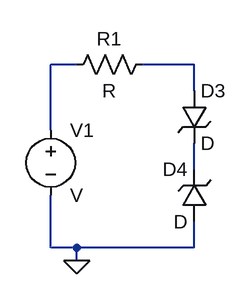
[diagram p0: schematic Draft1.asc]
Draft1.asc, the LTspice schematic file:
Version 4
SHEET 1 880 680
WIRE 160 48 128 48
WIRE 304 48 240 48
WIRE 304 80 304 48
WIRE 128 128 128 48
WIRE 304 176 304 144
WIRE 128 272 128 208
WIRE 160 272 128 272
WIRE 304 272 304 240
WIRE 304 272 160 272
WIRE 160 288 160 272
FLAG 160 288 0
SYMBOL res 256 32 R90
WINDOW 0 0 56 VBottom 2
WINDOW 3 32 56 VTop 2
SYMATTR InstName R1
SYMBOL zener 288 80 R0
SYMATTR InstName D3
SYMBOL zener 320 240 R180
WINDOW 0 24 64 Left 2
WINDOW 3 24 0 Left 2
SYMATTR InstName D4
SYMBOL voltage 128 112 R0
SYMATTR InstName V1

The netlist it stands for:
* Draft1.asc
R1 N002 N001 R
D3 N002 N003 D
D4 0 N003 D
V1 N001 0 V
.model D D
.lib standard.dio
.backanno
.end